# Altium schematic sheet Processor.SchDoc
size A3
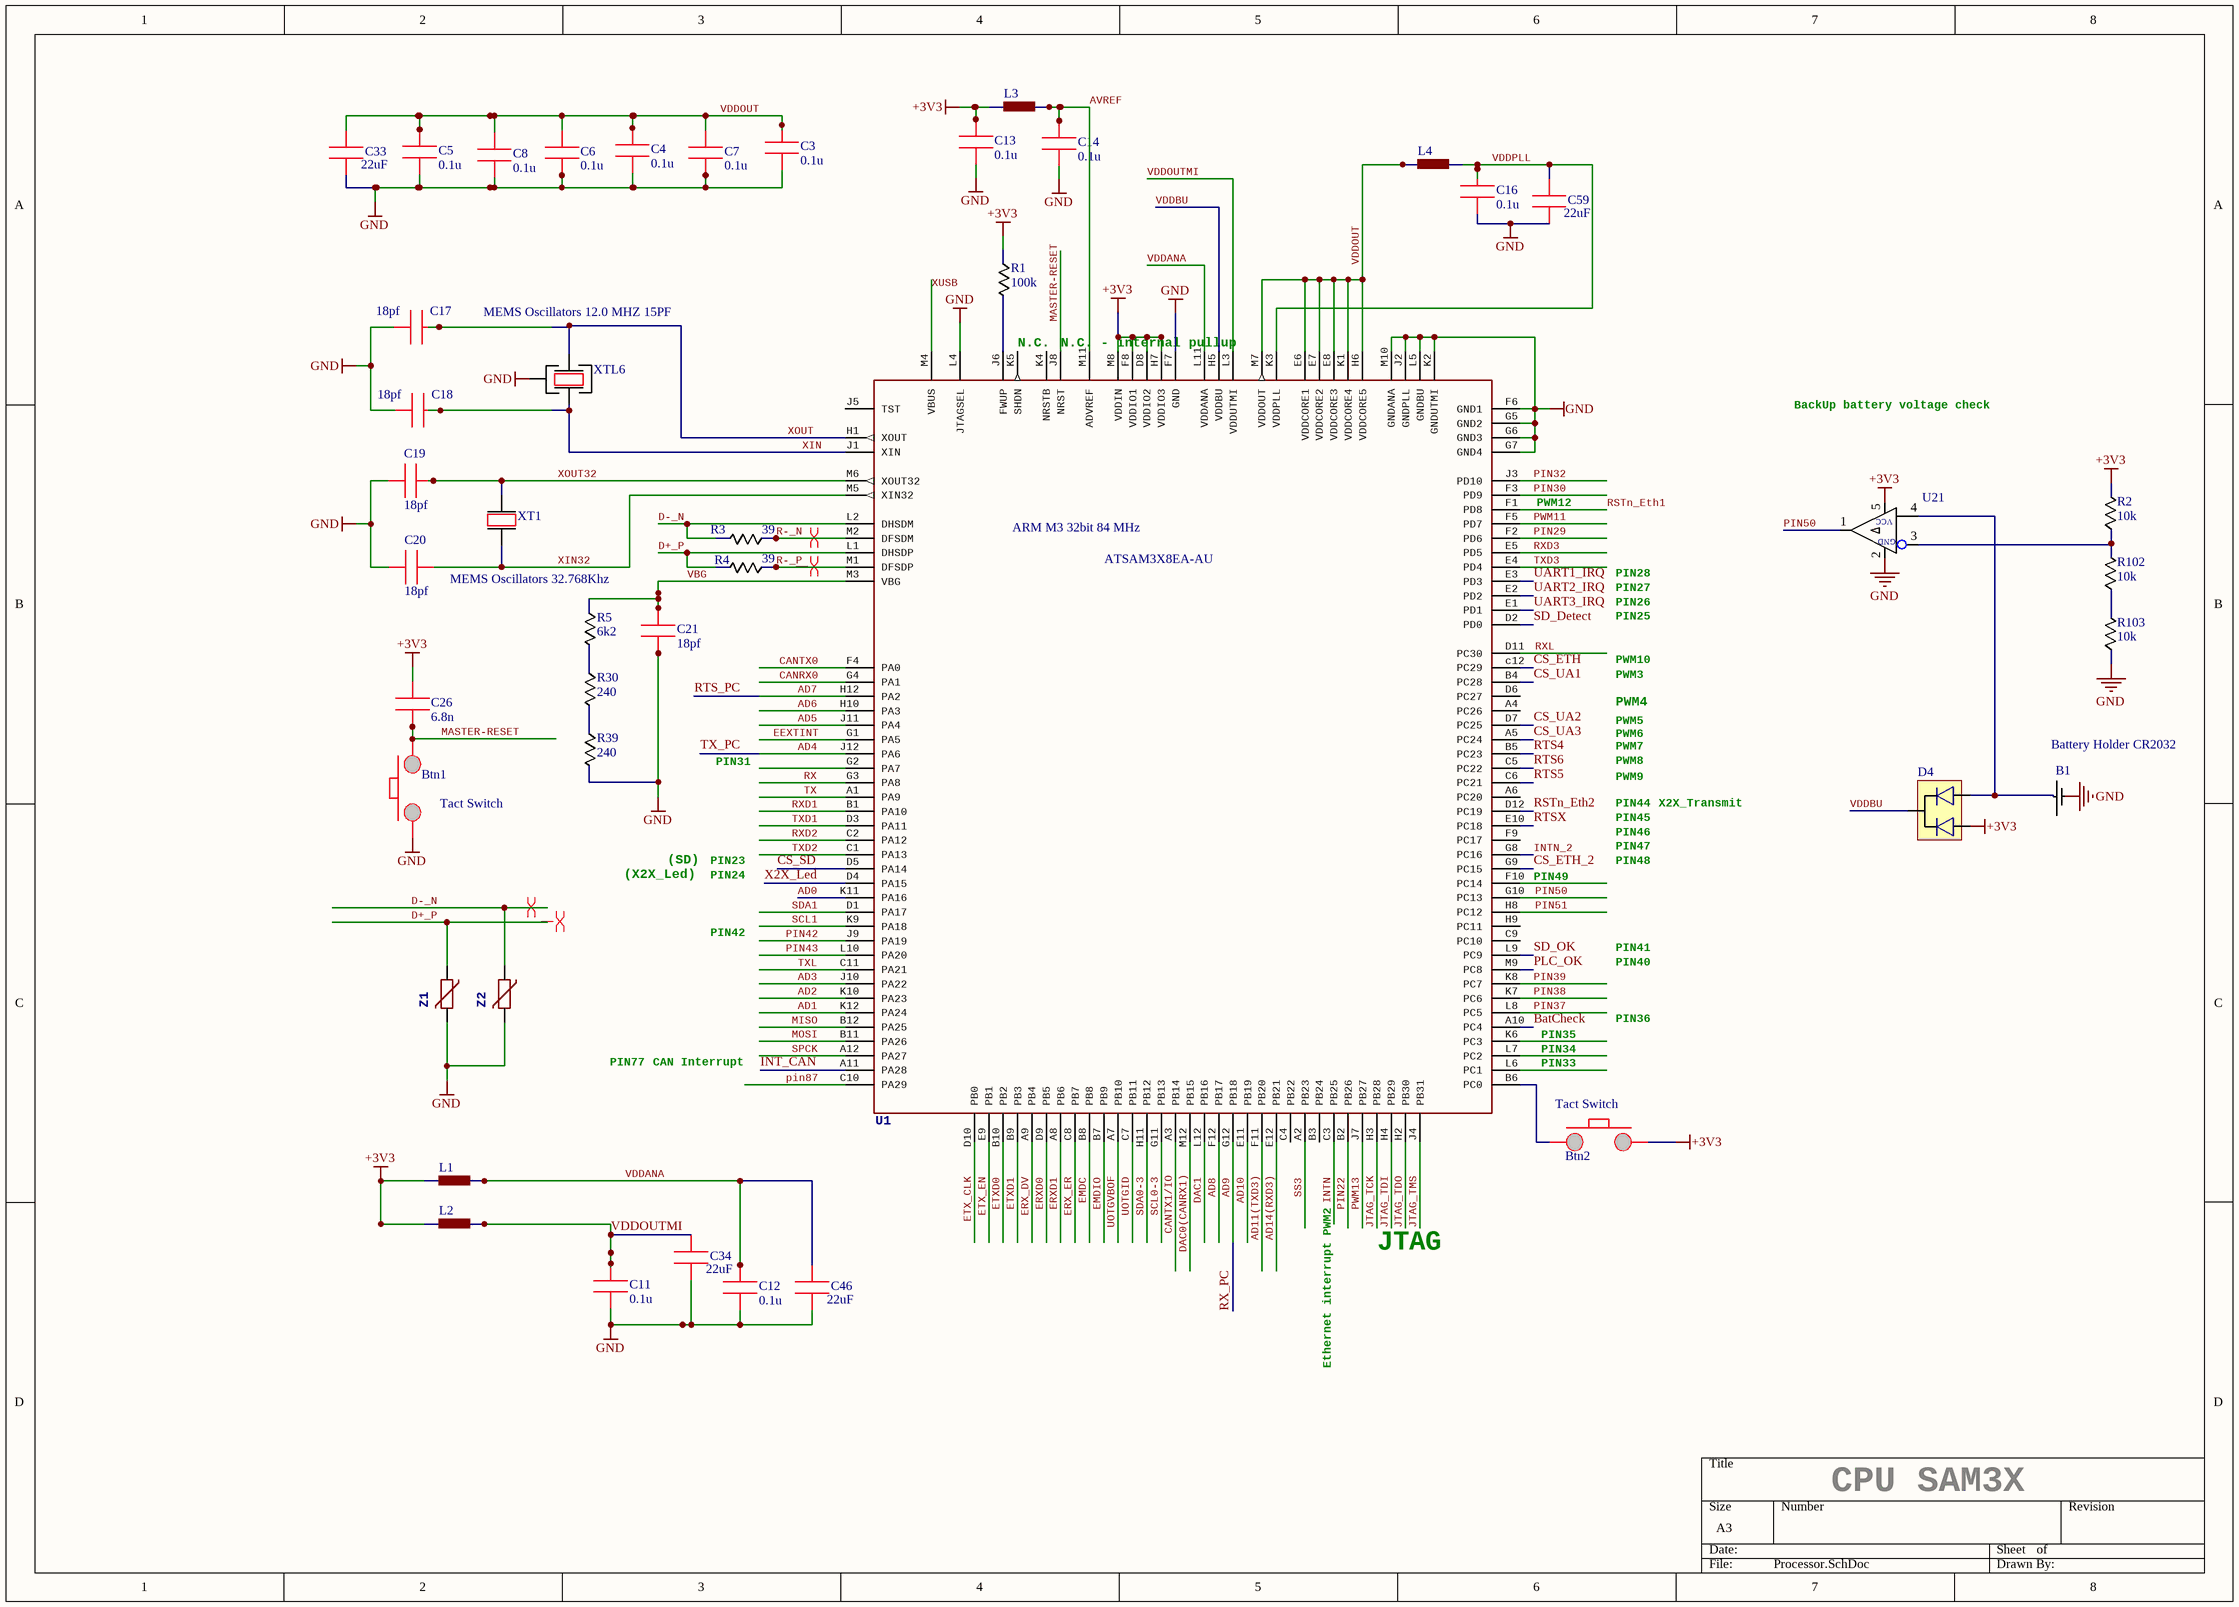
[diagram p0: Processor.SchDoc]

## Parts
B1  Part Description: Battery Holder CR2032  [Batt Holder CR2032]
Btn1  (no value)  [Tact Switch]
Btn2  (no value)  [Tact Switch]
C3  0.1u  [0603]
C4  0.1u  [0603]
C5  0.1u  [0603]
C6  0.1u  [0603]
C7  0.1u  [0603]
C8  0.1u  [0603]
C11  0.1u  [0603]
C12  0.1u  [0603]
C13  0.1u  [0603]
C14  0.1u  [0603]
C16  0.1u  [0603]
C17  18pf  [0603]
C18  18pf  [0603]
C19  18pf  [0603]
C20  18pf  [0603]
C21  18pf  [0603]
C26  6.8n  [0603]
C33  22uF  [1206]
C34  22uF  [1206]
C46  22uF  [1206]
C59  22uF  [1206]
D4  (no value)  [SOT23]
L1  (no value)  [0805]
L2  (no value)  [0805]
L3  (no value)  [0805]
L4  (no value)  [0805]
R1  100k  [0603]
R2  10k  [0603]
R3  39  [0603]
R4  39  [0603]
R5  6k2  [0603]
R30  240  [0603]
R39  240  [0603]
R102  10k  [0603]
R103  10k  [0603]
U1  Part Description: ARM M3 32bit 84 MHz  Part Number: ATSAM3X8EA-AU  [LFBGA 144]
U21  (no value)  [SOT23 - 5 lead]
XT1  Part Description: MEMS Oscillators 32.768Khz  [KX – 327]
XTL6  Part Description: MEMS Oscillators 12.0 MHZ 15PF  [KX-7 XTAL]
Z1  (no value)  [0603]
Z2  (no value)  [0603]

## Nets
+3V3: Btn2.1 C13.2 C26.2 D4.1 L1.1 L2.1 L3.1 R1.1 R2.2 U1.D8(VDDIO2) U1.F8(VDDIO1) U1.H7(VDDIO3) U1.M8(VDDIN) U21.5
GND: B1.0 Btn1.0 C3.1 C4.1 C5.1 C6.1 C7.1 C8.1 C11.1 C12.1 C13.1 C14.1 C16.1 C17.1 C18.1 C19.2 C20.2 C21.1 C33.1 C34.1 C46.1 C59.1 R39.2 R103.1 U1.F6(GND1) U1.F7(GND) U1.G5(GND2) U1.G6(GND3) U1.G7(GND4) U1.J2(GNDPLL) U1.K2(GNDUTMI) U1.L4(JTAGSEL) U1.L5(GNDBU) U1.M10(GNDANA) U21.2 XTL6.2 Z1.2 Z2.2
AD0: U1.K11(PA16)
AD1: U1.K12(PA24)
AD2: U1.K10(PA23)
AD3: U1.J10(PA22)
AD4: U1.J12(PA6)  [also labelled TX_PC]
AD5: U1.J11(PA4)
AD6: U1.H10(PA3)
AD7: U1.H12(PA2)  [also labelled RTS_PC]
AD8: U1.F12(PB17)
AD9: U1.G12(PB18)  [also labelled RX_PC]
AD10: U1.E11(PB19)
AD11(TXD3): U1.F11(PB20)
AD14(RXD3): U1.E12(PB21)
AVREF: C14.2 L3.2 U1.M11(ADVREF)
BatCheck: U1.A10(PC4)
CANRX0: U1.G4(PA1)
CANTX0: U1.F4(PA0)
CANTX1/IO: U1.A3(PB14)
CS_ETH: U1.c12(PC29)
CS_ETH_2: U1.G9(PC15)
CS_SD: U1.D5(PA14)
CS_UA1: U1.B4(PC28)
CS_UA2: U1.D7(PC25)
CS_UA3: U1.A5(PC24)
D+_P: R4.2 U1.L1(DHSDP) Z1.1
D-_N: R3.2 U1.L2(DHSDM) Z2.1
DAC0(CANRX1): U1.M12(PB15)
DAC1: U1.L12(PB16)
EEXTINT: U1.G1(PA5)
EMDC: U1.B8(PB8)
EMDIO: U1.B7(PB9)
ERX_DV: U1.A9(PB4)
ERX_ER: U1.C8(PB7)
ERXD0: U1.D9(PB5)
ERXD1: U1.A8(PB6)
ETX_CLK: U1.D10(PB0)
ETX_EN: U1.E9(PB1)
ETXD0: U1.B10(PB2)
ETXD1: U1.B9(PB3)
INT_CAN: U1.A11(PA28)
INTN: U1.C3(PB25)
INTN_2: U1.G8(PC16)
JTAG_TCK: U1.H3(PB28)
JTAG_TDI: U1.H4(PB29)
JTAG_TDO: U1.H2(PB30)
JTAG_TMS: U1.J4(PB31)
MASTER-RESET: Btn1.1 C26.1 U1.J8(NRST)
MISO: U1.B12(PA25)
MOSI: U1.B11(PA26)
PIN22: U1.B2(PB26)
PIN29: U1.F2(PD6)
PIN30: U1.F3(PD9)
PIN32: U1.J3(PD10)
PIN37: U1.L8(PC5)
PIN38: U1.K7(PC6)
PIN39: U1.K8(PC7)
PIN42: U1.J9(PA19)
PIN43: U1.L10(PA20)
PIN50: U1.G10(PC13) U21.1
PIN51: U1.H8(PC12)
pin87: U1.C10(PA29)
PLC_OK: U1.M9(PC8)
PWM11: U1.F5(PD7)
PWM13: U1.J7(PB27)
R-_N: R3.1 U1.M2(DFSDM)
R-_P: R4.1 U1.M1(DFSDP)
RSTn_Eth1: U1.F1(PD8)
RSTn_Eth2: U1.D12(PC19)
RTS4: U1.B5(PC23)
RTS5: U1.C6(PC21)
RTS6: U1.C5(PC22)
RTSX: U1.E10(PC18)
RX: U1.G3(PA8)
RXD1: U1.B1(PA10)
RXD2: U1.C2(PA12)
RXD3: U1.E5(PD5)
RXL: U1.D11(PC30)
SCL0-3: U1.G11(PB13)
SCL1: U1.K9(PA18)
SD_Detect: U1.D2(PD0)
SD_OK: U1.L9(PC9)
SDA0-3: U1.H11(PB12)
SDA1: U1.D1(PA17)
SPCK: U1.A12(PA27)
SS3: U1.A2(PB23)
TX: U1.A1(PA9)
TXD1: U1.D3(PA11)
TXD2: U1.C1(PA13)
TXD3: U1.E4(PD4)
TXL: U1.C11(PA21)
UART1_IRQ: U1.E3(PD3)
UART2_IRQ: U1.E2(PD2)
UART3_IRQ: U1.E1(PD1)
UOTGID: U1.C7(PB11)
UOTGVBOF: U1.A7(PB10)
VBG: C21.2 R5.1 U1.M3(VBG)
VDDANA: C12.2 C46.2 L1.2 U1.L11(VDDANA)
VDDBU: D4.3 U1.H5(VDDBU)
VDDOUT: C3.2 C4.2 C5.2 C6.2 C7.2 C8.2 C33.2 L4.1 U1.E6(VDDCORE1) U1.E7(VDDCORE2) U1.E8(VDDCORE3) U1.H6(VDDCORE5) U1.K1(VDDCORE4) U1.M7(VDDOUT)
VDDOUTMI: C11.2 C34.2 L2.2 U1.L3(VDDUTMI)
VDDPLL: C16.2 C59.2 L4.2 U1.K3(VDDPLL)
X2X_Led: U1.D4(PA15)
XIN: C18.2 U1.J1(XIN) XTL6.3
XIN32: C20.1 U1.M5(XIN32) XT1.1
XOUT: C17.2 U1.H1(XOUT) XTL6.1
XOUT32: C19.1 U1.M6(XOUT32) XT1.2
XUSB: U1.M4(VBUS)
NetB1_1: B1.1 D4.2 U21.4
NetBtn2_0: Btn2.0 U1.B6(PC0)
NetR1_2: R1.2 U1.J6(FWUP)
NetR2_1: R2.1 R102.2 U21.3
NetR5_2: R5.2 R30.1
NetR30_2: R30.2 R39.1
NetR102_1: R102.1 R103.2

Not connected (* = marked no-connect by the designer): U1 A4(PC26) A6(PC20) B3(PB24) C4(PB22) C9(PC10) D6(PC27) F9(PC17) F10(PC14) G2(PA7) H9(PC11) J5(TST) K4(NRSTB) K5(SHDN) K6(PC3) L6(PC1) L7(PC2)

## Layout directives
differential pair: (no net found under the mark)

## Notes on the sheet
- N.C.
- (near U1) N.C. - internal pullup
- BackUp battery voltage check
- (near U1) PWM12
- PIN28
- PIN27
- PIN26
- PIN25
- PWM3
- PWM10
- PIN31
- PWM5
- PWM6
- PWM7
- PWM8
- PWM4
- PWM9
- PIN44
- PIN46
- PIN45
- X2X_Transmit
- (X2X_Led)
- (SD)
- PIN23
- PIN24
- (near U1) PIN49
- PIN47
- PIN48
- PIN42
- PIN41
- PIN40
- (near U1) PIN35
- (near U1) PIN34
- PIN36
- PIN77
- CAN Interrupt
- PIN33
- PWM2
- JTAG
- Ethernet interrupt
- CPU SAM3X
- (in symbol TS391ILT) VCC; GND

## Library data of the parts
B1 = Batt Holder CR2032: Part Number: 1734178-1
Btn1 Btn2 = Tact Switch: Part Number: KLS7-TS6606-4.3-180; Part Description: Tact Switch
C3-C8 C11-C14 C16 = Capasitor 0805: Part Description: 0.1 uF 100 VDC 10% 0603 X7R; Part Number: GRM188R72A104KA35D
C17-C21 = Capasitor 0805: Part Description: 18 pF 50 VDC 5% 0603 C0G; Part Number: GRM1885C1H180JA01D
C26 = 0603 CAP: Part Description: 50V 6800pF X7R 0603 10%; Part Number: CC0603KRX7R9BB682
C33 C34 C46 C59 = 0805 Cap: Part Description: 16V 22uF X5R 1206; Part Number: CC1206KKX5R7BB226
D4 = BAT54C: Part Description: Schottky Diodes & Rectifiers Schottky, SOT-23, 30V, 0.2A; Part Number: BAT54C
L1-L4 = BLM21PG220SN1D: Part Description: Ferrite Beads 1000 OHM 25%  100 MHz; Part Number: BLM41PG102SN1L
R1 = Resistor 0805: Part Description: Resistor 0603, 100kOhms, 1%, 1/10W; Part Number: RC0603FR-07100KL
R2 R102 R103 = Resistor 0805: Part Description: Resistor 0603, 10kOhms, 5%, 1/10W; Part Number: RC0603JR-0710K
R3 R4 = Resistor 0805: Part Description: Resistor 0603, 39Ohms, 1%, 1/10W; Part Number: RC0603FR-0739RL
R5 = Resistor 0805: Part Description: Resistor 0603, 6.2kOhms, 5%, 1/10W; Part Number: RC0603JR-076K2L
R30 R39 = Resistor 0805: Part Description: Resistor 0603, 240Ohms, 1%, 1/10W; Part Number: RC0603FR-07240RL
U1 = ATSAM3X/AAU
U21 = TS391ILT: Part Description: Analog Comparators Lo-Pwr Sngl Voltage; Part Number: TS391ILT
XT1 = KX – 327XS: Part Number: KX – 327XS
XTL6 = KX-7: Part Number: Geyer KX-7 12.0 MHz
Z1 Z2 = VARISTORCN0603: Part Description: Chip Guard 0603 5 Volts; Part Number: CG0603MLC-05E